# EAGLE design lipo_warn (EAGLE 6.3)
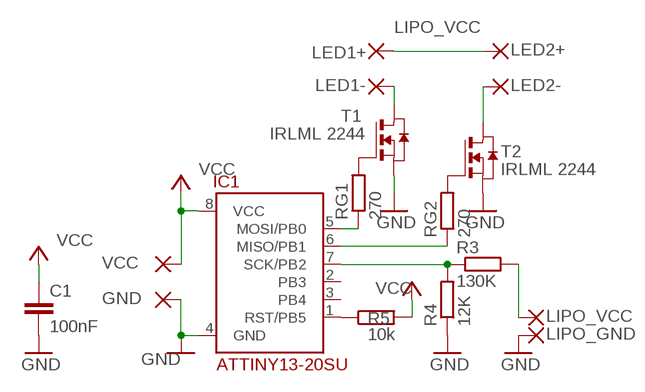
[diagram p0: schematic, sheet 1]

## Parts
C1  100nF  C-EUC1206  [C1206]
GND  SMD2  [SMD1,27-2,54]
IC1  ATTINY13-20SU  [SOIC8]
LED1+  WIREPADSMD1,27-254  [SMD1,27-2,54]
LED1-  WIREPADSMD1,27-254  [SMD1,27-2,54]
LED2+  WIREPADSMD1,27-254  [SMD1,27-2,54]
LED2-  WIREPADSMD1,27-254  [SMD1,27-2,54]
LIPO_GND  WIREPADSMD5-2,5  [5-2,5]
LIPO_VCC  WIREPADSMD5-2,5  [5-2,5]
R3  130K  R-EU_M1206  [M1206]
R4  12K  R-EU_M1206  [M1206]
R5  10k  R-EU_M1206  [M1206]
RG1  270  R-EU_M1206  [M1206]
RG2  270  R-EU_M1206  [M1206]
T1  IRLML 2244  NMOSSOT23  [SOT-23]
T2  IRLML 2244  NMOSSOT23  [SOT-23]
VCC  SMD2  [SMD1,27-2,54]

## Nets
GND: C1.2 GND.1(P) IC1.4(GND) LIPO_GND.1(P) R4.1 T1.2(S) T2.2(S)
LIPO_VCC: LED1+.1(P) LED2+.1(P)
N$1: IC1.1(RST/PB5) R5.1
N$2: IC1.5(MOSI/PB0) RG1.1
N$3: IC1.6(MISO/PB1) RG2.1
N$4: IC1.7(SCK/PB2) R3.1 R4.2
N$5: LIPO_VCC.1(P) R3.2
N$7: LED1-.1(P) T1.1(D)
N$8: RG1.2 T1.3(G)
N$9: RG2.2 T2.3(G)
N$10: LED2-.1(P) T2.1(D)
VCC: C1.1 IC1.8(VCC) R5.2 VCC.1(P)
Unconnected: IC1.2(PB3) IC1.3(PB4)

## Library data of the parts
C1 = rcl:C-EU: CAPACITOR, European symbol
GND VCC = wirepad:SMD2: SMD PAD
IC1 = attiny13:ATTINY13-20*
LED1+ LED1- LED2+ LED2- LIPO_GND LIPO_VCC = wirepad:WIREPAD: Wire PAD connect wire on PCB
R3-R5 RG1 RG2 = rcl:R-EU_: RESISTOR, European symbol
T1 T2 = msop8:NMOSSOT23: MOS FET; OC_FARNELL: unknown; OC_NEWARK: unknown

## Board
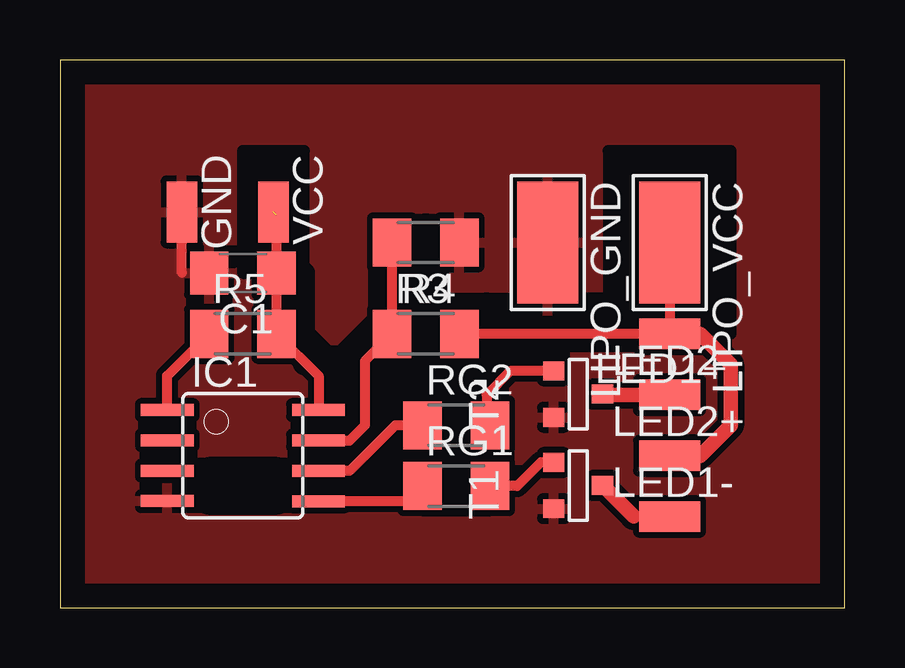
[diagram p1: board, top side]

Size 32.69 x 22.85 mm. Coordinates in mm from the lower left corner, seen from the top.
Outline: 0,0 32.69,0 32.69,22.85 0,22.85 0,0
Copper layers (1*16): Top 0.035mm / dielectric 1.5mm / Bottom 0.035mm
Design rules "default": minimum track width 10mil, minimum drill 24mil, track to track 8mil, track to pad 8mil, pad to pad 8mil, via to via 8mil, smd to smd 8mil, copper to edge 40mil, drill to drill 8mil, minimum pad ring 10mil, minimum via ring 8mil, stop-mask expansion 4mil, vias tented up to drill 0mil, thermal gap 10mil
tRestrict: area 7.6,14 to 10.2,19.1; area 22.9,11.4 to 27.9,19.1; 17 lines

### Footprints (pad centres in the part's own frame; a part is rotated, then mirrored left to right if it is on the bottom)
C1206 = smd 1.6 x 1.8: 1 -1.4,0; 2 1.4,0
SMD1,27-2,54 = smd 1.27 x 2.54: 1 0,0
SOIC8 = smd 0.5 x 2.2: 1 -1.905,-3.154; 2 -0.645,-3.154; 3 0.625,-3.154; 4 1.895,-3.154; 5 1.905,3.154; 6 0.635,3.154; 7 -0.635,3.154; 8 -1.905,3.154
5-2,5 = smd 2.54 x 5.08: 1 0,0
M1206 = smd 1.6 x 2: 1 -1.4,0; 2 1.4,0
SOT-23 = smd 0.787 x 0.889: 1 0.025,-1.016; 2 -0.94,1.016; 3 0.991,1.016

### Placement (x,y rotation side)
C1  7.62,13.97 180 top
GND  5.08,16.51 180 top
IC1  7.62,6.35 270 top
LED1+  25.4,11.43 90 top
LED1-  25.4,3.81 270 top
LED2+  25.4,6.35 270 top
LED2-  25.4,8.89 270 top
LIPO_GND  20.32,15.24 180 top
LIPO_VCC  25.4,15.24 180 top
R3  15.24,11.43 0 top
R4  15.24,15.24 180 top
R5  7.62,11.43 0 top
RG1  16.51,5.08 0 top
RG2  16.51,7.62 0 top
T1  21.59,5.08 90 top
T2  21.59,8.89 90 top
VCC  8.89,16.51 180 top

### Tracks (layer width: path | path; a pad name or v marks a point on that pad's centre or on a via)
GND
  Top 0.406: C1.2 6.35,13.97 | GND.1 5.08,15.24 5.08,13.97
  pour Top (isolate 0.254): 0,22.86 33.02,22.86 33.02,0 0,0
LIPO_VCC
  Top 0.406: LED1+.1 26.67,11.43 | 26.67,6.35 LED2+.1
  Top 0.61: 26.67,11.43 27.94,10.16 27.94,7.62 26.67,6.35
N$1
  Top 0.406: IC1.1 4.47,9.68 R5.1
N$2
  Top 0.406: RG1.1 14.47,4.45 IC1.5
N$3
  Top 0.406: RG2.1 13.97,7.62 12.06,5.71 IC1.6
N$4
  Top 0.406: R4.2 R3.1 12.7,10.29 12.7,7.62 12.06,6.99 IC1.7
N$5
  Top 0.406: LIPO_VCC.1 25.4,11.43 R3.2
N$7
  Top 0.406: 23.9,3.81 LED1-.1
  Top 0.61: T1.1 23.9,3.81
N$8
  Top 0.406: T1.3 20.04,6.07 19.05,5.08 RG1.2
  Top 0.813: RG1.2 17.78,5.08
N$9
  Top 0.406: T2.3 18.77,9.88 17.78,8.89 17.78,7.75 RG2.2
N$10
  Top 0.61: T2.1 23.09,8.89 LED2-.1
VCC  (1 unrouted)
  Top 0.406: 9.02,16.38 C1.1 R5.2 10.77,9.68 IC1.8

### Text on the board
tRestrict: Samuel Munz DHBW-Stuttg. V0.1